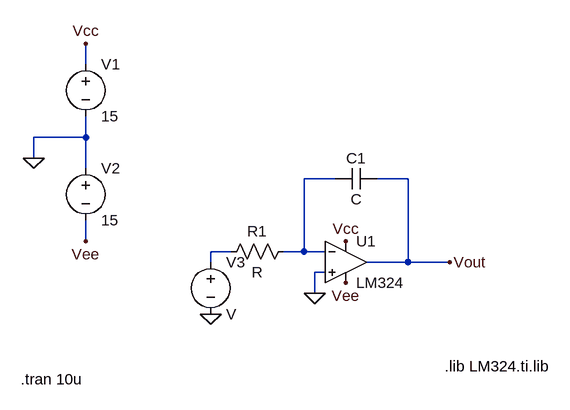
[diagram p0: schematic LM324Demo.asc]
LM324Demo.asc, the LTspice schematic file:
Version 4
SHEET 1 880 680
WIRE -208 -144 -208 -176
WIRE -208 -32 -208 -64
WIRE -208 -32 -288 -32
WIRE -288 0 -288 -32
WIRE -208 16 -208 -32
WIRE 176 32 128 32
WIRE 288 32 240 32
WIRE -208 128 -208 96
WIRE 16 144 -16 144
WIRE 128 144 128 32
WIRE 128 144 96 144
WIRE 160 144 128 144
WIRE -16 160 -16 144
WIRE 288 160 288 32
WIRE 288 160 224 160
WIRE 352 160 288 160
WIRE 160 176 144 176
WIRE 144 208 144 176
FLAG -288 0 0
FLAG -208 -176 Vcc
FLAG -208 128 Vee
FLAG 192 128 Vcc
FLAG 192 192 Vee
FLAG 352 160 Vout
FLAG 144 208 0
FLAG -16 240 0
SYMBOL Opamps\\opamp2 192 96 R0
SYMATTR InstName U1
SYMATTR Value LM324
SYMBOL voltage -208 -160 R0
SYMATTR InstName V1
SYMATTR Value 15
SYMBOL voltage -208 0 R0
WINDOW 123 0 0 Left 2
WINDOW 39 0 0 Left 2
SYMATTR InstName V2
SYMATTR Value 15
SYMBOL cap 240 16 R90
WINDOW 0 0 32 VBottom 2
WINDOW 3 32 32 VTop 2
SYMATTR InstName C1
SYMBOL res 112 128 R90
WINDOW 0 0 56 VBottom 2
WINDOW 3 32 56 VTop 2
SYMATTR InstName R1
SYMBOL voltage -16 144 R0
SYMATTR InstName V3
TEXT 344 320 Left 2 !.lib LM324.ti.lib
TEXT -308 340 Left 2 !.tran 10u

The netlist it stands for:
* LM324Demo.asc
XU1 0 N001 Vcc Vee Vout LM324  ; pins In+ In- V+ V- OUT
V1 Vcc 0 15
V2 0 Vee 15
C1 Vout N001 C
R1 N001 N002 R
V3 N002 0 V
.lib LM324.ti.lib
.tran 10u
.backanno
.end